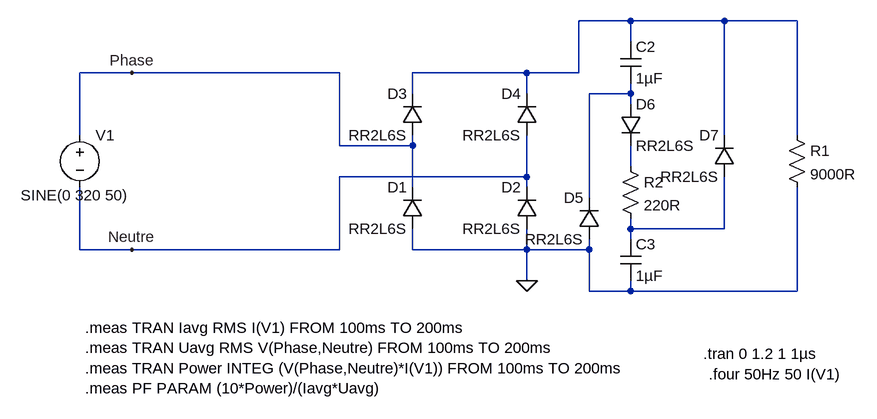
[diagram p0: schematic PFC-2Cap.asc]
PFC-2Cap.asc, the LTspice schematic file:
Version 4
SHEET 1 1656 680
WIRE 400 -112 320 -112
WIRE 544 -112 400 -112
WIRE 656 -112 544 -112
WIRE 400 -80 400 -112
WIRE -368 -32 -448 -32
WIRE -48 -32 -368 -32
WIRE 240 -32 64 -32
WIRE 320 -32 320 -112
WIRE 320 -32 240 -32
WIRE 64 0 64 -32
WIRE 240 0 240 -32
WIRE 400 0 400 -16
WIRE 400 0 336 0
WIRE 400 16 400 0
WIRE -448 64 -448 -32
WIRE 544 64 544 -112
WIRE 656 64 656 -112
WIRE -48 80 -48 -32
WIRE 64 80 64 64
WIRE 64 80 -48 80
WIRE 400 112 400 80
WIRE 240 128 240 64
WIRE 240 128 -48 128
WIRE 64 144 64 80
WIRE 240 144 240 128
WIRE 336 160 336 0
WIRE 400 208 400 192
WIRE 544 208 544 128
WIRE 544 208 400 208
WIRE 400 224 400 208
WIRE -448 240 -448 144
WIRE -368 240 -448 240
WIRE -48 240 -48 128
WIRE -48 240 -368 240
WIRE 64 240 64 208
WIRE 240 240 240 208
WIRE 240 240 64 240
WIRE 336 240 336 224
WIRE 336 240 240 240
WIRE 240 288 240 240
WIRE 336 304 336 240
WIRE 400 304 400 288
WIRE 400 304 336 304
WIRE 656 304 656 144
WIRE 656 304 400 304
FLAG 240 288 0
FLAG -368 240 Neutre
FLAG -368 -32 Phase
SYMBOL diode 80 208 R180
WINDOW 0 24 64 Left 2
WINDOW 3 24 0 Left 2
SYMATTR InstName D1
SYMATTR Value RR2L6S
SYMBOL diode 256 208 R180
WINDOW 0 24 64 Left 2
WINDOW 3 24 0 Left 2
SYMATTR InstName D2
SYMATTR Value RR2L6S
SYMBOL diode 80 64 R180
WINDOW 0 24 64 Left 2
WINDOW 3 24 0 Left 2
SYMATTR InstName D3
SYMATTR Value RR2L6S
SYMBOL diode 256 64 R180
WINDOW 0 24 64 Left 2
WINDOW 3 24 0 Left 2
SYMATTR InstName D4
SYMATTR Value RR2L6S
SYMBOL voltage -448 48 R0
WINDOW 123 0 0 Left 0
WINDOW 39 0 0 Left 0
WINDOW 3 -91 108 Left 2
SYMATTR Value SINE(0 320 50)
SYMATTR InstName V1
SYMBOL res 640 48 R0
SYMATTR InstName R1
SYMATTR Value 9000R
SYMBOL cap 384 -80 R0
SYMATTR InstName C2
SYMATTR Value 1µF
SYMBOL cap 384 224 R0
SYMATTR InstName C3
SYMATTR Value 1µF
SYMBOL diode 352 224 R180
WINDOW 0 24 64 Left 2
WINDOW 3 24 0 Left 2
SYMATTR InstName D5
SYMATTR Value RR2L6S
SYMBOL diode 384 16 R0
SYMATTR InstName D6
SYMATTR Value RR2L6S
SYMBOL res 384 96 R0
SYMATTR InstName R2
SYMATTR Value 220R
SYMBOL diode 560 128 R180
WINDOW 0 24 64 Left 2
WINDOW 3 24 0 Left 2
SYMATTR InstName D7
SYMATTR Value RR2L6S
TEXT 512 400 Left 2 !.tran 0 1.2 1 1µs
TEXT 520 432 Left 2 !.four 50Hz 50 I(V1)
TEXT -440 360 Left 2 !.meas TRAN Iavg RMS I(V1) FROM 100ms TO 200ms\n.meas TRAN Uavg RMS V(Phase,Neutre) FROM 100ms TO 200ms\n.meas TRAN Power INTEG (V(Phase,Neutre)*I(V1)) FROM 100ms TO 200ms\n.meas PF PARAM (10*Power)/(Iavg*Uavg)

The netlist it stands for:
* PFC-2Cap.asc
D1 0 Phase RR2L6S
D2 0 Neutre RR2L6S
D3 Phase N001 RR2L6S
D4 Neutre N001 RR2L6S
V1 Phase Neutre SINE(0 320 50)
R1 N001 0 9000R
C2 N001 N002 1µF
C3 N004 0 1µF
D5 0 N002 RR2L6S
D6 N002 N003 RR2L6S
R2 N003 N004 220R
D7 N004 N001 RR2L6S
.model D D
.lib standard.dio
.tran 0 1.2 1 1µs
.four 50Hz 50 I(V1)
.meas TRAN Iavg RMS I(V1) FROM 100ms TO 200ms
.meas TRAN Uavg RMS V(Phase,Neutre) FROM 100ms TO 200ms
.meas TRAN Power INTEG (V(Phase,Neutre)*I(V1)) FROM 100ms TO 200ms
.meas PF PARAM (10*Power)/(Iavg*Uavg)
.backanno
.end